# EAGLE design D1_CM (EAGLE 9.6.2)
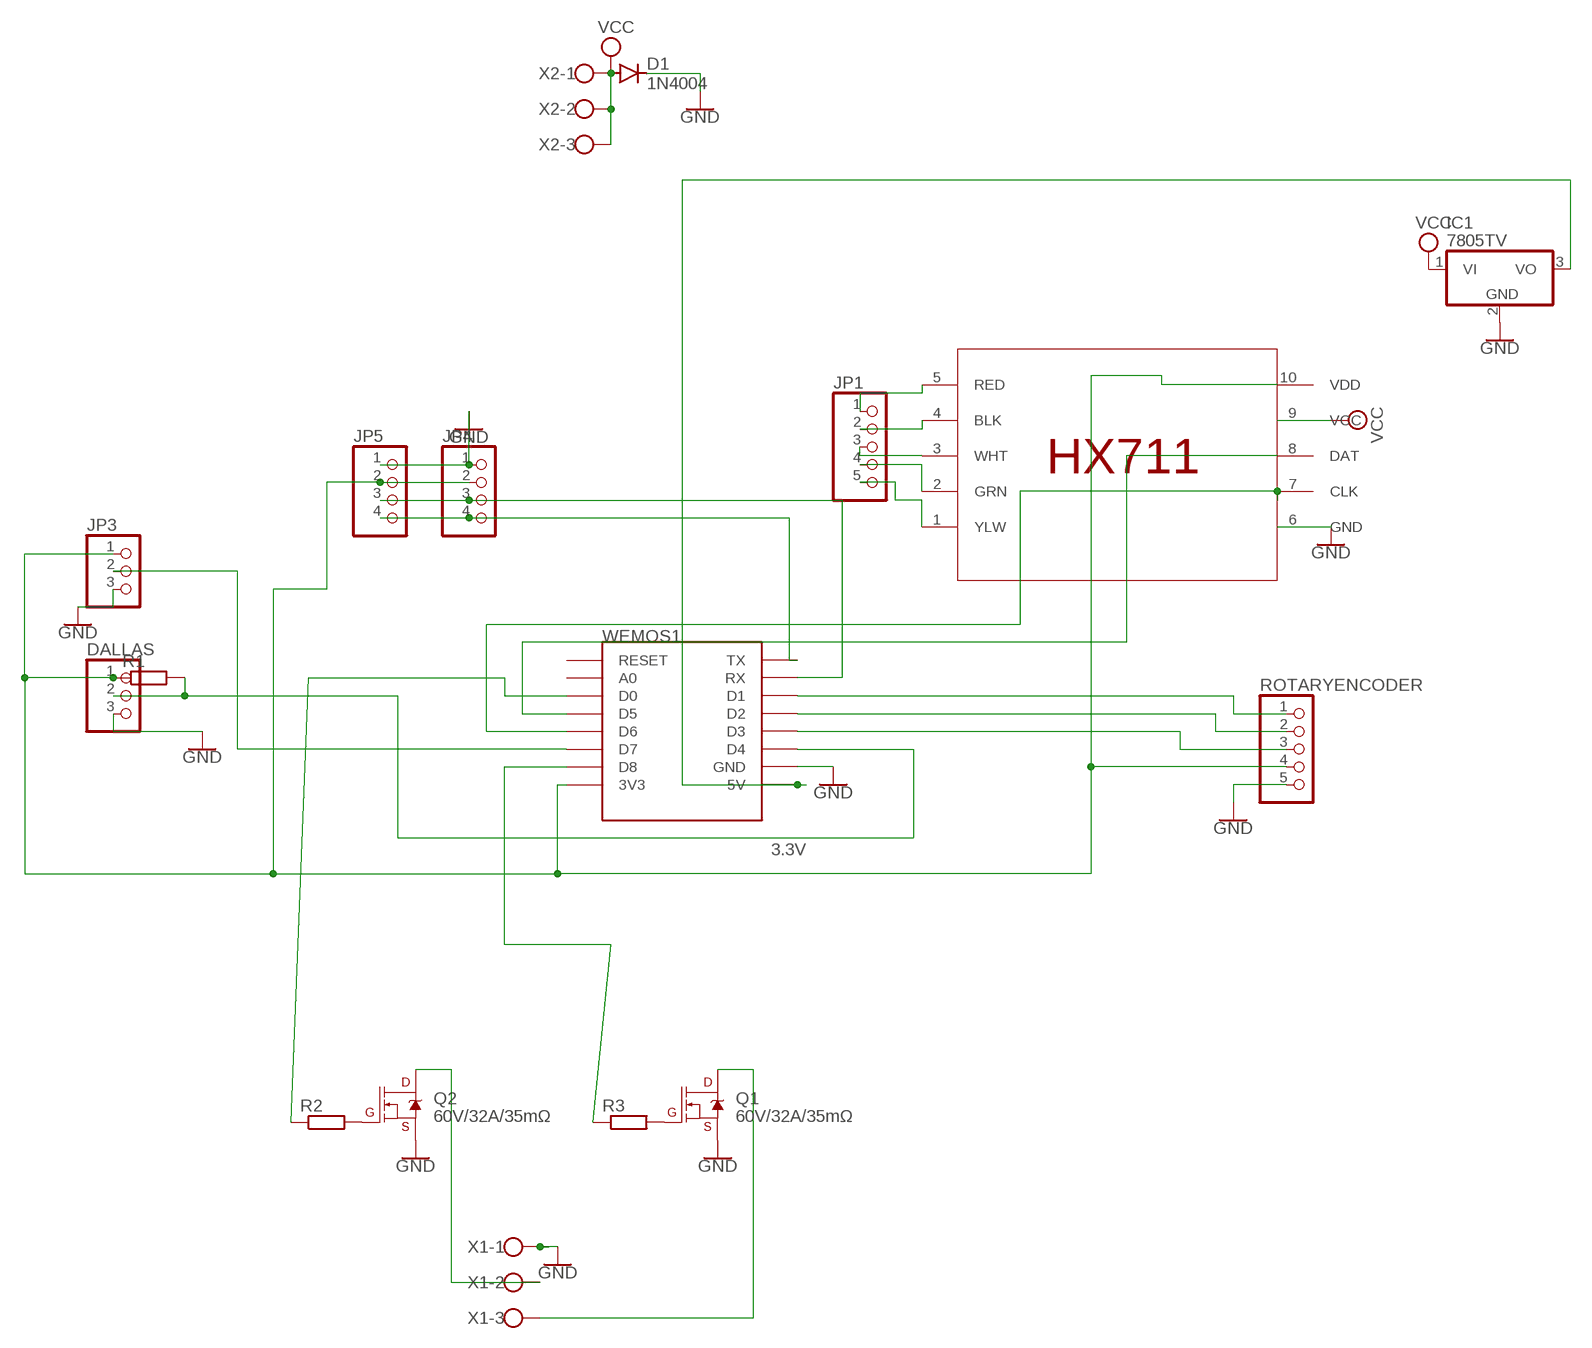
[diagram p0: schematic, sheet 1]

## Parts
D1  1N4004  [DO41-10]
DALLAS  PINHD-1X3  [1X03]
IC1  7805TV  [TO220V]
JP1  PINHD-1X5  [1X05]
JP3  PINHD-1X3  [1X03]
JP4  PINHD-1X4  [1X04]
JP5  PINHD-1X4  [1X04]
Q1  60V/32A/35mΩ  MOSFET-NCH-FQP30N06L  [TO220V]
Q2  60V/32A/35mΩ  MOSFET-NCH-FQP30N06L  [TO220V]
R1  R-EU_0207/7  [0207/7]
R2  R-EU_0207/7  [0207/7]
R3  R-EU_0207/7  [0207/7]
ROTARYENCODER  PINHD-1X5  [1X05]
U$1  DEVICY  [FOOTSY]
WEMOS1  WEMOS-D1-MINI  [WEMOS-D1-MINI]
X1  W237-103  [W237-103]
X2  W237-103  [W237-103]

## Nets
3.3V: DALLAS.1 JP3.1 JP4.2 JP5.2 R1.1 ROTARYENCODER.4 U$1.10(VDD) WEMOS1.3V3
GND: D1.C DALLAS.3 IC1.2(GND) JP3.3 JP4.1 JP5.1 Q1.3(S) Q2.3(S) ROTARYENCODER.5 U$1.6(GND) WEMOS1.GND X1.1
N$1: JP1.1 U$1.5(RED)
N$2: JP1.2 U$1.4(BLK)
N$3: JP1.3 U$1.3(WHT)
N$4: JP1.4 U$1.2(GRN)
N$5: JP1.5 U$1.1(YLW)
N$7: DALLAS.2 R1.2 WEMOS1.D4
N$8: Q2.1(G) R2.2
N$9: JP4.3 JP5.3 WEMOS1.RX
N$10: JP4.4 JP5.4 WEMOS1.TX
N$11: Q1.1(G) R3.2
N$12: ROTARYENCODER.2 WEMOS1.D2
N$13: ROTARYENCODER.1 WEMOS1.D1
N$15: R2.1 WEMOS1.D0
N$16: R3.1 WEMOS1.D8
N$17: Q2.2(D) X1.2
N$18: Q1.2(D) X1.3
N$19: U$1.8(DAT) WEMOS1.D5
N$20: U$1.7(CLK) WEMOS1.D6
N$21: JP3.2 WEMOS1.D7
N$22: ROTARYENCODER.3 WEMOS1.D3
N$23: IC1.3(VO) WEMOS1.5V
VCC: D1.A IC1.1(VI) U$1.9(VCC) X2.1 X2.2 X2.3
Unconnected: WEMOS1.A0 WEMOS1.RESET

## Library data of the parts
D1 = diode:1N4004: DIODE general purpose rectifier, 1 A
DALLAS JP3 = pinhead:PINHD-1X3: PIN HEADER
IC1 = linear:78*: Positive VOLTAGE REGULATOR Source: http://cache.national.com/ds/LM/LM78L05.pdf http://www.fairchildsemi.com/ds/LM/LM7805.pdf
JP1 ROTARYENCODER = pinhead:PINHD-1X5: PIN HEADER
JP4 JP5 = pinhead:PINHD-1X4: PIN HEADER
Q1 Q2 = SparkFun-DiscreteSemi:MOSFET-NCH: N-channel MOSFETs Voltage controlled devices that allow control of high current outputs. SparkFun Products: SparkFun OpenScale <https://www.sparkfun.com/products/13261> SparkFun Digital Sandbox <https://www.sparkfun.com/products/12651> SparkFun Monster Moto Shield <https://www.sparkfun.com/products/10182> SparkFun MOSFET Power Controller <https://www.sparkfun.com/products/11214>; PROD_ID: TRANS-10060
R1-R3 = rcl:R-EU_: RESISTOR, European symbol; SPICEPREFIX: R
U$1 = hx711:DEVICY
WEMOS1 = esp8266modules:WEMOS-D1-MINI: WeMos.cc D1 mini ESP8266 module
X1 X2 = con-wago-500:W237-103: WAGO SCREW CLAMP; MPN: 237-103; OC_FARNELL: unknown; OC_NEWARK: 18M7116

## Board
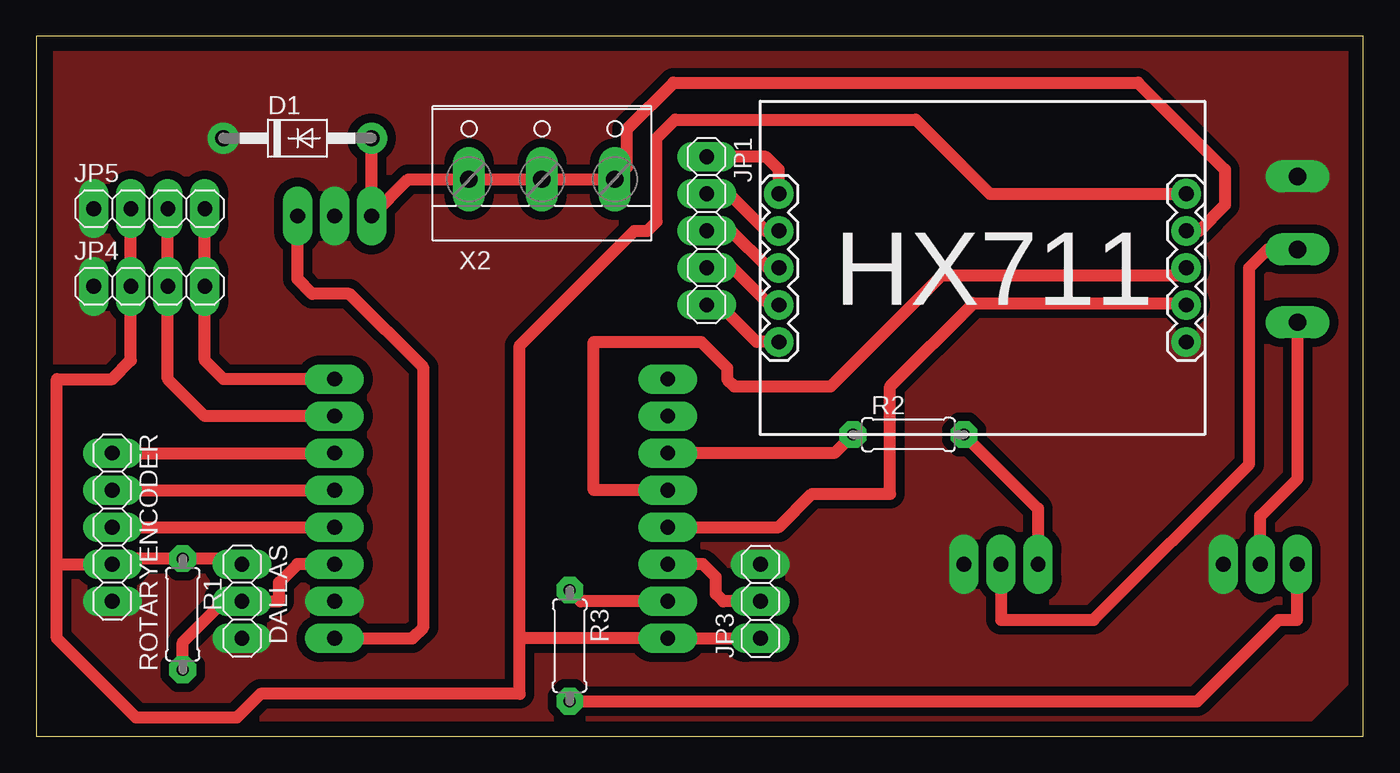
[diagram p1: board, top side]
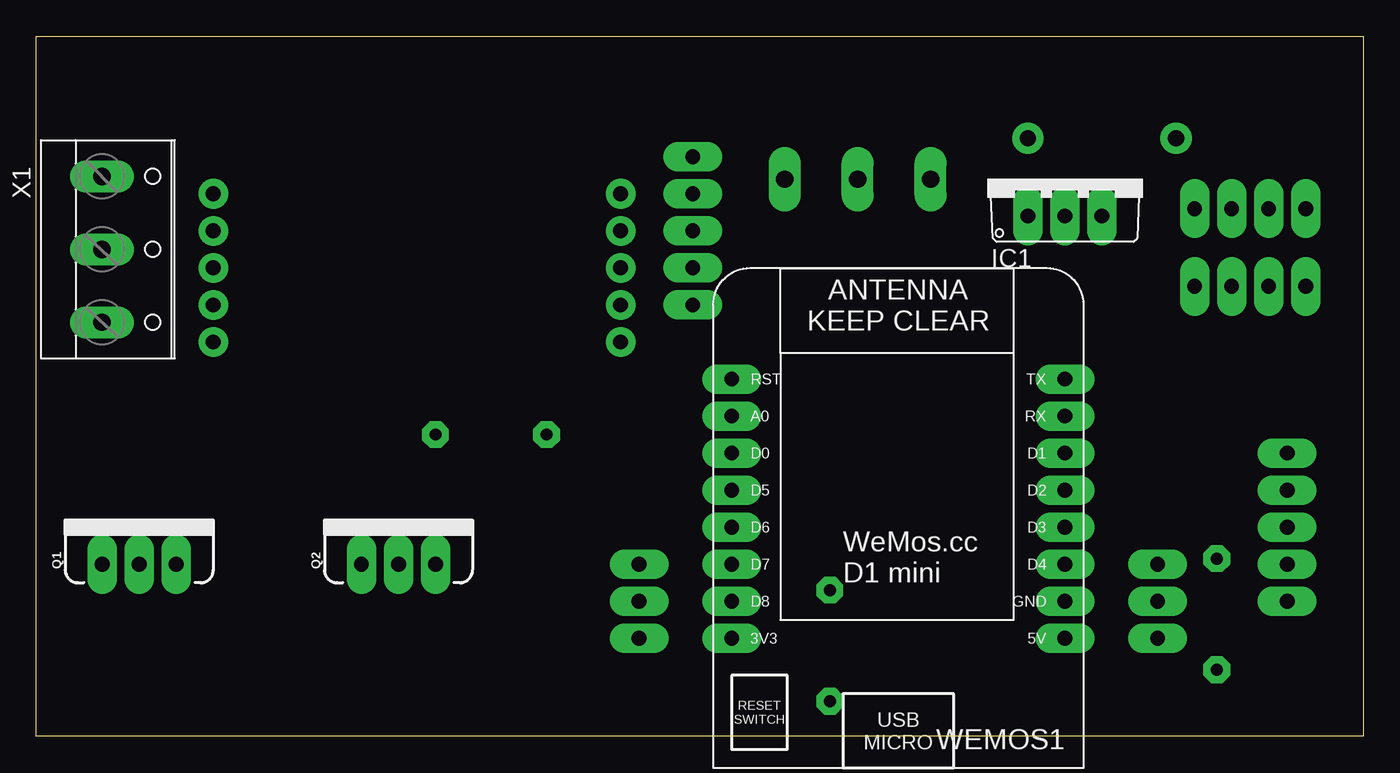
[diagram p2: board, bottom side, seen from below]

Size 91 x 48 mm. Coordinates in mm from the lower left corner, seen from the top.
Outline: 0,0 91,0 91,48 0,48 0,0
Copper layers (1*16): Top 0.035mm / dielectric 1.5mm / Bottom 0.035mm
Design rules "default *": minimum track width 6mil, minimum drill 0.35mm, track to track 6mil, track to pad 6mil, pad to pad 6mil, via to via 6mil, smd to smd 6mil, copper to edge 40mil, drill to drill 6mil, minimum pad ring 20mil, minimum via ring 8mil, stop-mask expansion 4mil, vias tented up to drill 0mil, thermal gap 0mil

### Footprints (pad centres in the part's own frame; a part is rotated, then mirrored left to right if it is on the bottom)
DO41-10 = drill 1.118: A 5.08,0; C -5.08,0
1X03 = drill 1.016 long: 1 -2.54,0; 2 0,0; 3 2.54,0
TO220V = drill 1.016 long: 1 -2.54,-2.54; 2 0,-2.54; 3 2.54,-2.54
1X05 = drill 1.016 long: 1 -5.08,0; 2 -2.54,0; 3 0,0; 4 2.54,0; 5 5.08,0
1X04 = drill 1.016 long: 1 -3.81,0; 2 -1.27,0; 3 1.27,0; 4 3.81,0
TO220V' = drill 1.016 long: 1 -2.54,0; 2 0,0; 3 2.54,0
0207/7 = drill 0.813 octagon: 1 -3.81,0; 2 3.81,0
FOOTSY = drill 1.016 pad 1.88: 1 1.27,6.35; 2 1.27,8.89; 3 1.27,11.43; 4 1.27,13.97; 5 1.27,16.51; 6 29.21,6.35; 7 29.21,8.89; 8 29.21,11.43; 9 29.21,13.97; 10 29.21,16.51
WEMOS-D1-MINI = drill 1.016 pad 1.829 long: 3V3 -10.16,-10.16; 5V 12.7,-10.16; A0 -10.16,5.08; D0 -10.16,2.54; D1 12.7,2.54; D2 12.7,0; D3 12.7,-2.54; D4 12.7,-5.08; D5 -10.16,0; D6 -10.16,-2.54; D7 -10.16,-5.08; D8 -10.16,-7.62; GND 12.7,-7.62; RESET -10.16,7.62; RX 12.7,5.08; TX 12.7,7.62
W237-103 = drill 1.194 long: 1 -5,-1.29; 2 0,-1.29; 3 5,-1.29

### Placement (x,y rotation side)
D1  17.91,41.02 0 top
DALLAS  14.1,9.27 270 top
IC1  20.45,38.23 0 bottom
JP1  45.97,34.67 270 top
JP3  49.66,9.27 90 top
JP4  7.75,30.86 0 top
JP5  7.75,36.2 0 top
Q1  60V/32A/35mΩ  [TO220V']  83.95,11.81 0 bottom
Q2  60V/32A/35mΩ  [TO220V']  66.17,11.81 0 bottom
R1  10.03,8.38 270 top
R2  59.82,20.7 0 top
R3  36.58,6.22 270 top
ROTARYENCODER  5.21,14.35 270 top
U$1  49.66,20.7 0 top
WEMOS1  33.15,16.89 0 bottom
X1  85.22,33.4 270 bottom
X2  34.67,39.5 0 top

### Tracks (layer width: path | path; a pad name or v marks a point on that pad's centre or on a via)
3.3V
  Top 0.813: 33.15,6.73 WEMOS1.3V3 JP3.1 | 33.15,6.73 33.15,2.92 15.37,2.92 13.74,1.29 6.83,1.29 1.4,6.73 1.4,11.81 | 1.4,11.81 ROTARYENCODER.4 5.59,12.19 R1.1 13.72,12.19 DALLAS.1 | 1.4,11.81 1.4,24.51 5.21,24.51 6.48,25.78 JP4.2 JP5.2 | 33.15,6.73 33.15,26.8 41.02,34.67 41.91,34.67 42.55,35.31 42.55,41.02 43.81,42.29 60.33,42.29 65.41,37.21 U$1.10
GND
  pour Top (isolate 0.6): 1.4,48.13 89.92,48.13 89.92,3.81 86.11,0 86.11,0 1.4,0
N$1
  Top 0.813: U$1.5 50.93,38.86 50.04,39.75 JP1.1
N$2
  Top 0.813: U$1.4 50.04,34.67 47.5,37.21 JP1.2
N$3
  Top 0.813: U$1.3 50.16,32.13 47.62,34.67 JP1.3
N$4
  Top 0.813: U$1.2 50.29,29.59 47.75,32.13 JP1.4
N$5
  Top 0.813: U$1.1 49.4,27.05 46.86,29.59 JP1.5
N$7
  Top 0.813: WEMOS1.D4 17.91,11.81 16.64,10.54 16.64,9.27 DALLAS.2 12.83,9.27 10.03,6.48 R1.2
N$8
  Top 0.813: Q2.1 68.71,15.62 R2.2
N$9
  Top 0.813: WEMOS1.RX 11.56,21.97 9.02,24.51 JP4.3 JP5.3
N$10
  Top 0.813: WEMOS1.TX 12.83,24.51 11.56,25.78 JP4.4 JP5.4
N$11
  Top 0.813: R3.2 79.63,2.41 85.22,8 86.49,8 Q1.1
N$12
  Top 0.813: ROTARYENCODER.2 WEMOS1.D2
N$13
  Top 0.813: ROTARYENCODER.1 WEMOS1.D1
N$15
  Top 0.813: R2.1 54.74,19.43 WEMOS1.D0
N$16
  Top 0.813: WEMOS1.D8 37.34,9.27 R3.1
N$17
  Top 0.813: Q2.2 66.17,8 72.52,8 83.19,18.67 83.19,32.13 84.45,33.4 X1.2
N$18
  Top 0.813: Q1.2 83.95,15.11 86.51,17.67 X1.3
N$19
  Top 0.813: WEMOS1.D5 38.23,16.89 38.23,27.05 45.59,27.05 47.37,25.27 47.37,24.51 47.88,24 54.48,24 62.1,31.62 78.36,31.62 U$1.8
N$20
  Top 0.813: WEMOS1.D6 50.93,14.35 53.21,16.64 58.55,16.64 58.55,24 64.26,29.72 78.74,29.72 U$1.7
N$21
  Top 0.813: JP3.2 47.12,9.27 46.61,9.78 46.61,10.92 45.72,11.81 WEMOS1.D7
N$22
  Top 0.813: ROTARYENCODER.3 WEMOS1.D3
N$23
  Top 0.813: WEMOS1.5V 25.78,6.73 26.54,7.49 26.54,25.27 21.46,30.35 18.92,30.35 17.91,31.37 IC1.3
VCC
  Top 0.813: D1.A IC1.1 25.51,38.21 X2.1 X2.2 X2.3 40.51,39.05 40.51,41.66 43.69,44.83 75.56,44.83 81.53,38.86 81.53,36.45 79.76,34.67 U$1.9